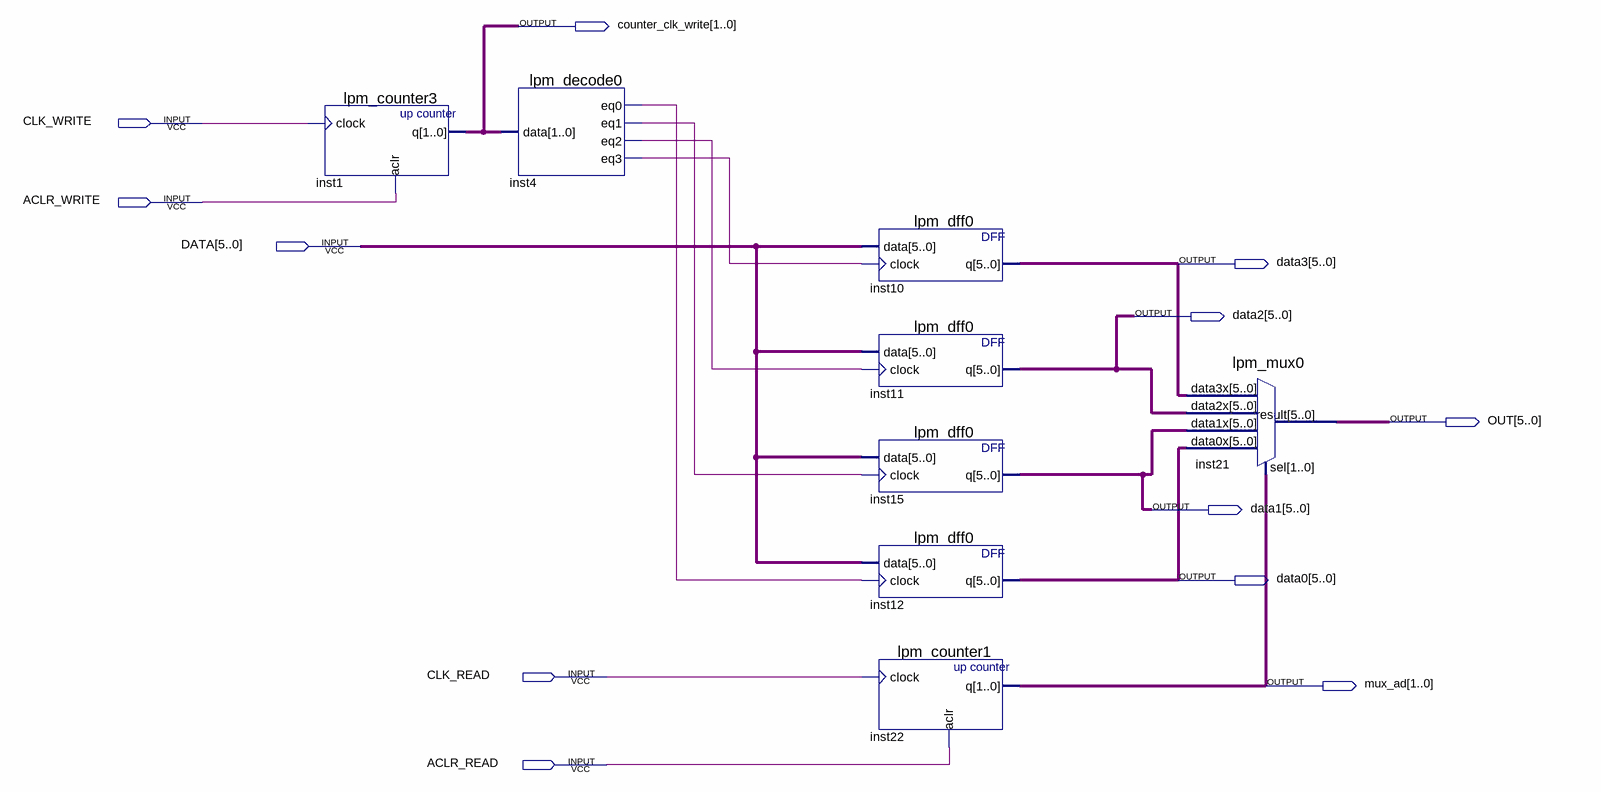
[diagram p0: schematic sheet]
// Quartus schematic test.bdf as structural Verilog: 8 symbols, 12 pins
module test (
  input  CLK_WRITE,
  input  ACLR_WRITE,
  input  [5:0] DATA,
  input  CLK_READ,
  input  ACLR_READ,
  output [1:0] counter_clk_write,
  output [5:0] data3,
  output [5:0] data2,
  output [5:0] OUT,
  output [5:0] data1,
  output [5:0] data0,
  output [1:0] mux_ad
);

  wire inst4_eq0, inst4_eq1, inst4_eq2, inst4_eq3;

  lpm_counter3 inst1 (.clock(CLK_WRITE), .aclr(ACLR_WRITE), .q(counter_clk_write));
  lpm_decode0 inst4 (.data(counter_clk_write), .eq0(inst4_eq0), .eq1(inst4_eq1), .eq2(inst4_eq2), .eq3(inst4_eq3));
  lpm_dff0 inst10 (.data(DATA), .clock(inst4_eq3), .q(data3));
  lpm_dff0 inst11 (.data(DATA), .clock(inst4_eq2), .q(data2));
  lpm_dff0 inst15 (.data(DATA), .clock(inst4_eq1), .q(data1));
  lpm_dff0 inst12 (.data(DATA), .clock(inst4_eq0), .q(data0));
  lpm_counter1 inst22 (.clock(CLK_READ), .aclr(ACLR_READ), .q(mux_ad));
  lpm_mux0 inst21 (.data3x(data3), .data2x(data2), .data1x(data1), .data0x(data0), .sel(mux_ad), .result(OUT));
endmodule
